# Altium project Solder-Station.PrjPcb
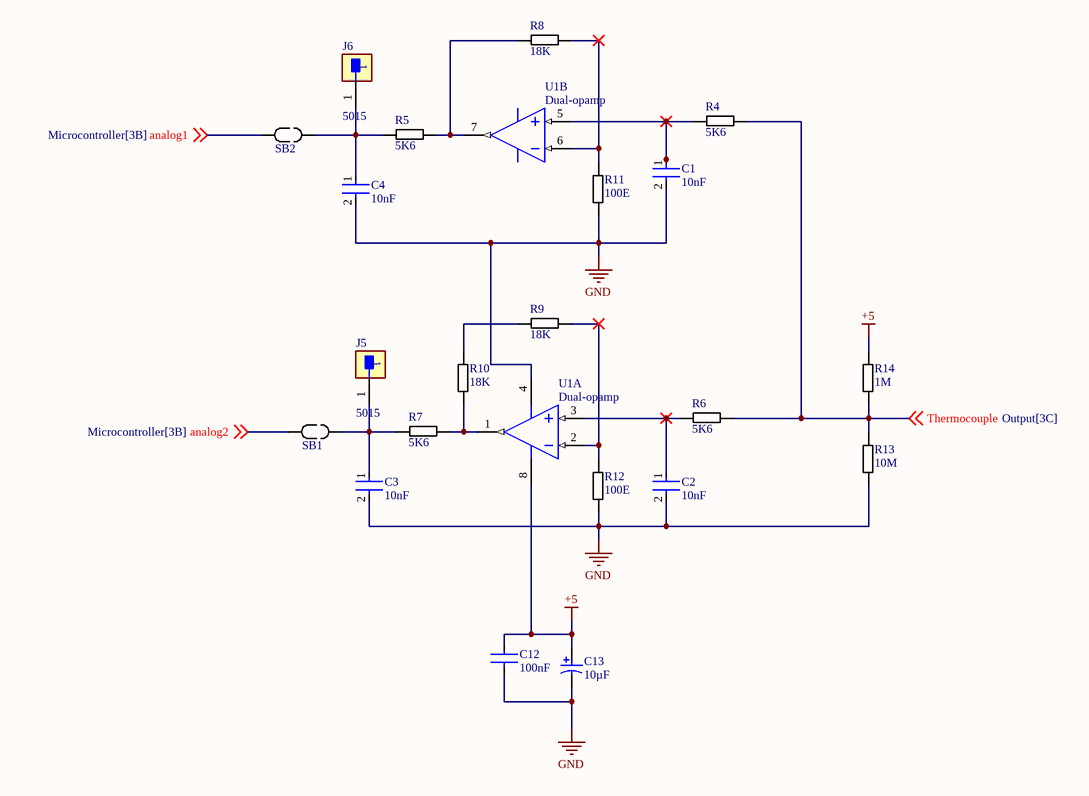
[diagram p0: Thermokoppel.SchDoc]
BladTitel: Soldeerstation; Numberofpages: 5; RevisionNumber: Rev1
4 sheets, 70 parts. Net scope: global (net labels, ports and power ports of the same name join across sheets).
Board file: PCB1.PcbDoc
Sheets:
  Thermokoppel.SchDoc
  Voeding.SchDoc
  Microcontroller.SchDoc
  Output.SchDoc

## Sheet Thermokoppel.SchDoc
size A4; SheetNumber: 1; SheetTotal: 4

### Parts
C1  10nF  [RESC2013X50X30ML20T20]
C2  10nF  [RESC2013X50X30ML20T20]
C3  10nF  [RESC2013X50X30ML20T20]
C4  10nF  [RESC2013X50X30ML20T20]
C12  100nF  [RESC2013X50X30ML20T20]
C13  10µF  [CAP-SMD_BD4.0-L4.3-W4.3-FD-LS5.3]
J5  5015  [5015]
J6  5015  [5015]
R4  5K6  [RESC2013X50X30ML20T20]
R5  5K6  [RESC2013X50X30ML20T20]
R6  5K6  [RESC2013X50X30ML20T20]
R7  5K6  [RESC2013X50X30ML20T20]
R8  18K  [RESC2013X50X30ML20T20]
R9  18K  [RESC2013X50X30ML20T20]
R10  18K  [RESC2013X50X30ML20T20]
R11  100E  [RESC2013X50X30ML20T20]
R12  100E  [RESC2013X50X30ML20T20]
R13  10M  [RESC2013X50X30ML20T20]
R14  1M  [RESC2013X50X30ML20T20]
SB1  SolderBridge  [SolderBridge]  (value not drawn)
SB2  SolderBridge  [SolderBridge]  (value not drawn)
U1  Dual-opamp  [MSOP_8_S]  (parts A,B of 2)

### Nets
+5: C12.1 C13.1(+) R14.2 U1.8(VDD)
GND: C1.2 C2.2 C3.2 C4.2 C12.2 C13.2(-) R11.1 R12.1 R13.1 U1.4(VSS)
analog1: SB2.1 ; off-sheet analog1
analog2: SB1.1 ; off-sheet analog2
Thermocouple: R4.2 R6.2 R13.2 R14.1 ; off-sheet Thermocouple
NetC1_1: C1.1 R4.1 U1.5(VINB+)
NetC2_1: C2.1 R6.1 U1.3(VINA+)
NetC3_1: C3.1 J5.1 R7.1 SB1.2
NetC4_1: C4.1 J6.1 R5.1 SB2.2
NetR5_2: R5.2 R8.1 U1.7(VOUTB)
NetR7_2: R7.2 R10.1 U1.1(VOUTA)
NetR8_2: R8.2 R11.2 U1.6(VINB-)
NetR9_1: R9.1 R10.2
NetR9_2: R9.2 R12.2 U1.2(VINA-)

### Library data of the parts
C1-C4 C12 = Capacitor: Voltage Rating (DC): 6.3V; Dielectric: X5R; Capacitance: 10uF; Material: Ceramic; Tolerance: 20%; Packaging: Tape and Reel; Width: 0.031inch; Termination: SMD/SMT; Package Quantity: 4000; Voltage Rating: 6.3V; Case/Package: 0603; Min Operating Temperature: -55°C; Voltage: 6.3V; Length: 1.6mm; Thickness: 0.035inch; Lead Free: Lead Free; Depth: 0.8mm; Case Code (Imperial): 0603; Max Operating Temperature: 85°C; Height: 0.8mm; Mount: Surface Mount; REACH SVHC: No SVHC; Radiation Hardening: No; Case Code (Metric): 1608
C13 = Electrolytic capacitor: Manufacturer: Panasonic; Voltage Rating: 25 V; ComponentLink2URL: http://industrial.panasonic.com/cdbs/www-data/pdf/RDE0000/ABA0000C1181.pdf; Height: 10.2 mm; Max Operating Temperature: 105 degC; PackageReference: EEE-FK1E221P; ComponentLink1Description: Manufacturer URL; ComponentLink1URL: http://www.panasonic.com/; Mount: Surface Mount; REACH SVHC: No SVHC; Min Operating Temperature: -55 degC; ComponentLink2Description: Datasheet; DatasheetVersion: 03/2016; Length: 10.2 mm; RoHSCompliant: true; Packaging: Tape and Reel; Package Quantity: 500; Lead Pitch: 3.1 mm; Pins: 2; PackageDescription: 2-Pin Electrolytic Aluminum Capacitor, Body 8.3 x 8.3 mm; Mounting Technology: Surface Mount
J5 J6 = Testpoint: PC TEST POINT MINIATURE; Manufacturer: keystone; Number Of Contacts: 1; Conn Orientation: Straight; Category: Conn; Manufacturer Part Number: 5015; Digikey Description: PC TEST POINT MINIATURE; Automotive: No; Lead Free: Yes; Octopart: https://octopart.com/5015-keystone-3822; ComponentLink2URL: http://www.keyelco.com/product-pdf.cfm?p=1353; Package: 5015; RoHS: TRUE; Device Class L3: unset; Device Class L2: unset; Contact Material: Silver; Device Class L1: Connectors; Height: 1.65mm; ComponentLink2Description: Datasheet
R4-R14 = Resistor: Manufacturer: Vishay Dale; Part Number: CRCW08050000Z0EA
U1 = Dual-opamp: Slew Rate: 0.6V/µs; Supply Current: 100uA; Power Supply Rejection Ratio (PSRR): 86dB; Input Offset Voltage (Vos): 4.5mV; Input Bias Current: 1pA; Amplifier Type: GENERAL PURPOSE; Unity Gain Bandwidth Product: 1MHz; Number of Circuits: 2; Output Current: 23mA; Operating Supply Voltage: 5.5V; Min Supply Voltage: 1.8V; Common Mode Rejection Ratio: 60dB; Voltage Gain: 112dB; Max Supply Voltage: 6V; Package Quantity: 60; REACH SVHC: No SVHC; Min Operating Temperature: -40°C; Max Operating Temperature: 125°C; Mount: Through Hole; Nominal Supply Current: 100uA; Height: 3.3mm; Length: 9.27mm; Slew Rate-Nom: 0.6V/µs; Packaging: Rail/Tube; Output Current per Channel: 23mA; Number of Amplifiers: 2; RoHS Compliant: Yes; Radiation Hardening: No; Bandwidth: 1MHz; Lead Free: Lead Free; Width: 6.35mm; Number of Channels: 2; Gain Bandwidth Product: 1MHz; Technology: CMOS; Operating Supply Current: 100uA; Number of Elements: 2; Number of Pins: 8; Input Offset Voltage-Max: 4.5mV; Case/Package: PDIP

## Sheet Voeding.SchDoc
size A4; SheetNumber: 2; SheetTotal: 4
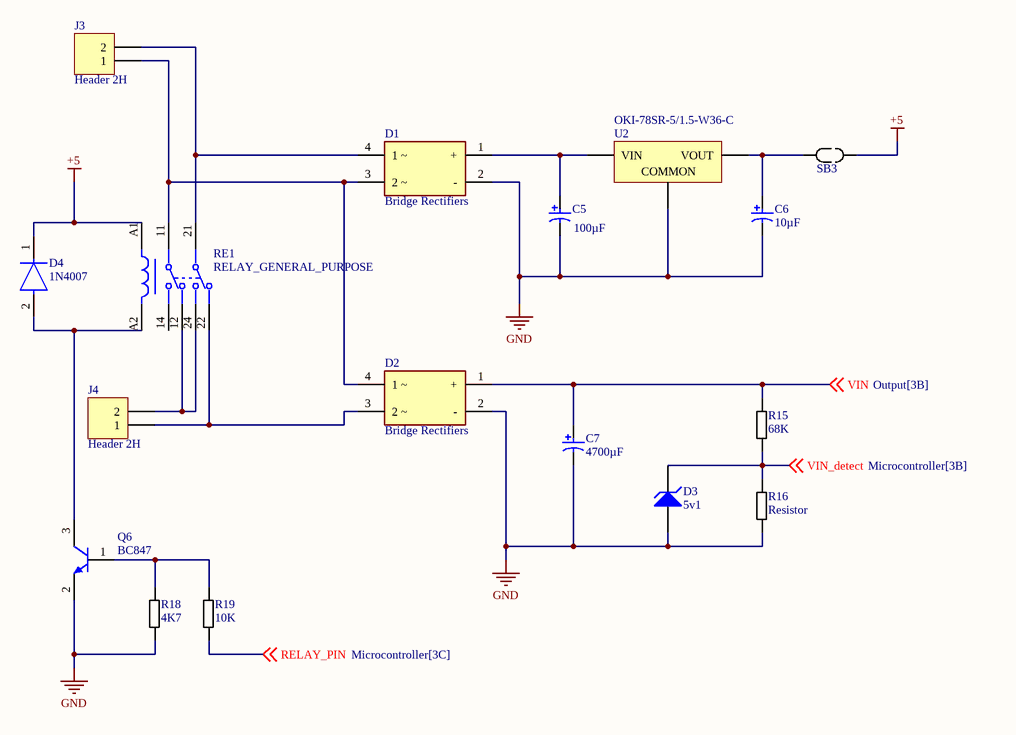
[diagram p1: Voeding.SchDoc]

### Parts
C5  100µF  [CAP-SMD_BD8.0-L8.3-W8.3-FD]
C6  10µF  [CAP-SMD_BD4.0-L4.3-W4.3-FD-LS5.3]
C7  4700µF  [CAP-TH_BD25.0-P10.00-D1.4-FD]
D1  Bridge Rectifiers  [TTF]
D2  Bridge Rectifiers  [TTF]
D3  5v1  [FP-SOD123-IPC_C]
D4  1N4007  [SOD-123FL]
J3  Header 2H  [Connector_2x1_p_5mm]
J4  Header 2H  [Connector_2x1_p_5mm]
Q6  BC847  [FAIR-SOT23-3_V]
R15  68K  [RESC2013X50X30ML20T20]
R16  Resistor  [RESC2013X50X30ML20T20]
R18  4K7  [RESC2013X50X30ML20T20]
R19  10K  [RESC2013X50X30ML20T20]
RE1  RELAY_GENERAL_PURPOSE  [RT42]
SB3  SolderBridge  [SolderBridge_BIG]  (value not drawn)
U2  OKI-78SR-5/1.5-W36-C  [OKI78SR515W36C]

### Nets
+5: D4.1(C) RE1.A1 SB3.2
GND: C5.2(-) C6.2(-) C7.2(-) D1.2(-) D2.2(-) D3.2(A) Q6.2(E) R16.1 R18.1 U2.2(COMMON)
RELAY_PIN: R19.1 ; off-sheet RELAY_PIN
VIN: C7.1(+) D2.1(+) R15.2 ; off-sheet VIN
VIN_detect: D3.1(K) R15.1 R16.2 ; off-sheet VIN_detect
NetC5_1: C5.1(+) D1.1(+) U2.1(VIN)
NetC6_1: C6.1(+) SB3.1 U2.3(VOUT)
NetD1_3: D1.3(2_~) D2.4(1_~) J3.1 RE1.11
NetD1_4: D1.4(1_~) J3.2 RE1.21
NetD2_3: D2.3(2_~) J4.1 RE1.22
NetD4_2: D4.2(A) Q6.3(C) RE1.A2
NetJ4_2: J4.2 RE1.12 RE1.24
NetQ6_1: Q6.1(B) R18.2 R19.2

Not connected (* = marked no-connect by the designer): RE1 14

### Library data of the parts
C5-C7 = Electrolytic capacitor: as C13 on sheet Thermokoppel; ComponentLink2URL: http://industrial.panasonic.com/cdbs/www-data/pdf/RDE0000/ABA0000C1181.pdf; Height: 10.2 mm; Max Operating Temperature: 105 degC; PackageReference: EEE-FK1E221P; ComponentLink1Description: Manufacturer URL; ComponentLink1URL: http://www.panasonic.com/; Mount: Surface Mount; REACH SVHC: No SVHC; Min Operating Temperature: -55 degC; ComponentLink2Description: Datasheet; DatasheetVersion: 03/2016; Length: 10.2 mm; RoHSCompliant: true; Packaging: Tape and Reel; Package Quantity: 500; Lead Pitch: 3.1 mm; Pins: 2; PackageDescription: 2-Pin Electrolytic Aluminum Capacitor, Body 8.3 x 8.3 mm; Mounting Technology: Surface Mount
D1 D2 = Bridge Rectifiers: Manufacturer Part Number: GBPC3510W T0; Manufacturer: Taiwan Semiconductor; Max Repetitive Reverse Voltage: 1000V; Peak Reverse Current: 5uA; Max Surge Forward Current: 400A; Forward Current: 35A; Max Junction Temp: +150°C; RoHS: TRUE; Package: GBPC-W; Reverse Voltage: 1000V; Temperature Range High: +150°C; Lead Free: Yes; ComponentLink2Description: Datasheet; Temperature Range Low: -55°C; Device Class L3: Rectifier Diodes; Temperature: -55°C to +150°C; Category: Diode; Octopart: https://octopart.com/gbpc3510w+t0-taiwan+semiconductor-12450781; Height: 11.23mm; ComponentLink2URL: https://www.taiwansemi.com/products/datasheet/GBPC%2015005%20SERIES_K14.pdf; Automotive: No; Device Class L2: Diodes; Device Class L1: Discrete Semiconductors
D3 = Zener: Manufacturer: On Semiconductor; PartNumber: 1SMB5928BT3G; VZ Typ (V): 13; Packing: Tape and Reel; PackageDescription: 2-Pin Small Molded Package, J-Bend Lead, Body 4.33 x 3.625 mm; PackageVersion: Rev. H, 05/2011; ComponentLink1Description: Manufacturer URL; Mounting Technology: Surface Mount; ComponentLink1URL: http://www.onsemi.com/; ComponentLink2Description: Datasheet; ComponentLink3URL: http://www.onsemi.com/pub_link/Collateral/1SMB5913BT3-D.PDF; PackageReference: SMB-2-403A-03_H; ComponentLink2URL: http://www.onsemi.com/pub_link/Collateral/1SMB5913BT3-D.PDF; DatasheetVersion: Rev. 8; RoHS: Pb-Free; ComponentLink3Description: Package Specification
D4 = Diode: Manufacturer: Vishay; Manufacturer Part Number: 1N4007-E3/54; Value: 15pF; Max Junction Temp: +150°C; Max Surge Forward Current: 30A; Forward Current: 1A; Max Repetitive Reverse Voltage: 1000V; Peak Reverse Current: 30uA; Octopart: https://octopart.com/1n4007-e3%2F54-vishay-39548207; Digikey Description: DIODE GEN PURP 1KV 1A DO204AL; Category: Diode; Mouser Description: Rectifiers Vr/1000V Io/1A; Automotive: No; Package: 1N4007; Device Class L3: Rectifier Diodes; Temperature Range High: +150°C; Capacitance: 15pF; Ipc Land Pattern Name: DIOPA1088W105L520D270; Lead Free: Yes; ComponentLink2Description: Datasheet; Device Class L1: Discrete Semiconductors; ComponentLink2URL: http://www.vishay.com/docs/88503/1n4001.pdf; Temperature Range Low: -50°C; Height: 2.7mm; RoHS: TRUE; Temperature: -50°C to +150°C; Device Class L2: Diodes
J3 J4 = Header 2H: Header, 2-Pin, Right Angle; LatestRevisionDate: 17-Jul-2002; LatestRevisionNote: Re-released for DXP Platform.; Publisher: Altium Limited
Q6 = NPN Transistor: Manufacturer: On Semiconductor; PartNumber: BC547BRL1G; IC Continuous (A): 0.1; fT Min (MHz): 150; Packing: Tape and Reel; Polarity: NPN; ComponentLink2URL: http://www.onsemi.com/pub_link/Collateral/BC546-D.PDF; ComponentLink1URL: http://www.onsemi.com/; ComponentLink2Description: Datasheet; RoHS: TRUE; ComponentLink3Description: Package Specification; ComponentLink1Description: Manufacturer URL; ComponentLink3URL: http://www.onsemi.com/pub_link/Collateral/MAC97-D.PDF; PackageDescription: 3-Pin Transistor Outline, Body 4.825 x 3.685 mm, Pitch 1.27 mm; PackageVersion: Rev. AM; DatasheetVersion: Rev. 7; Mounting Technology: Through Hole; PackageReference: TO-92-3-29-11_AM_BL
R15 R16 R18 R19 = Resistor: as R4 on sheet Thermokoppel
RE1 = RELAY_GENERAL_PURPOSE: Manufacturer Part Number: RT424005; Manufacturer: TE Connectivity; Coil Power: 403mW; Throw Configuration: DPDT; Coil Voltage: 5V; Number Of Contacts: 2; Coil Resistance: 62Ω; Current Rating: 8A; Coil Type: Non-Latching; Category: Relay; Octopart: https://octopart.com/5-1393243-9-te+connectivity-41835766; Device Class L3: Power Relays; ComponentLink2URL: https://www.te.com/commerce/DocumentDelivery/DDEController?Action=showdoc&DocId=Data+Sheet%7FRT2%7F1014%7Fpdf%7FEnglish%7FENG_DS_RT2_1014.pdf%7F5-1393243-9; Ambient Temperature Range High: +85°C; ComponentLink2Description: Datasheet; Digikey Description: RELAY GENERAL PURPOSE DPDT 8A 5V; Package: RT424005; Automotive: No; Device Class L1: Electromechanical; Height: 15.7mm; Device Class L2: Relays; Ambient Temperature Range Low: -40°C; Mouser Description: General Purpose Relay, Rt2 Series, Power, Non Latching, Dpdt, 5 Vdc, 8 A Rohs Compliant: Yes; Lead Free: Yes; RoHS: TRUE
U2 = DC/DC Converter: Manufacturer: Murata; Current - Output (Max): 1.5A; Power (Watts) - Max: 8W; Efficiency: 90.5%; Voltage - Input (Min): 7V; Voltage - Input (Max): 36V; Voltage - Output 1: 5V; Number of Outputs: 1; Package / Case: 3-SIPModule; Features: SCP; Type: LinearRegulatorReplacement; Size / Dimension: 0.41"Lx0.30"Wx0.65"H(10.4mmx7.6mmx16.5mm); Datasheet URL: https://datasheet.ciiva.com/8006/1790439-8006672.pdf; Datasheet Version: Oct-13; Power (Watts) - Manufacture Series: 8W; Voltage - Output 2: -; Series: Okami™OKI-78SR; Family: DCDCConverters; Manufacturer URL: http://www.murata.com/; Category: PowerSupplies-BoardMount; Voltage - Isolation: -; Packaging: Tube; Applications: ITE(Commercial); Mounting Type: ThroughHole; Voltage - Output 3: -; Operating Temperature: -40degC~85degC

## Sheet Microcontroller.SchDoc
size A4; SheetNumber: 3; SheetTotal: 4
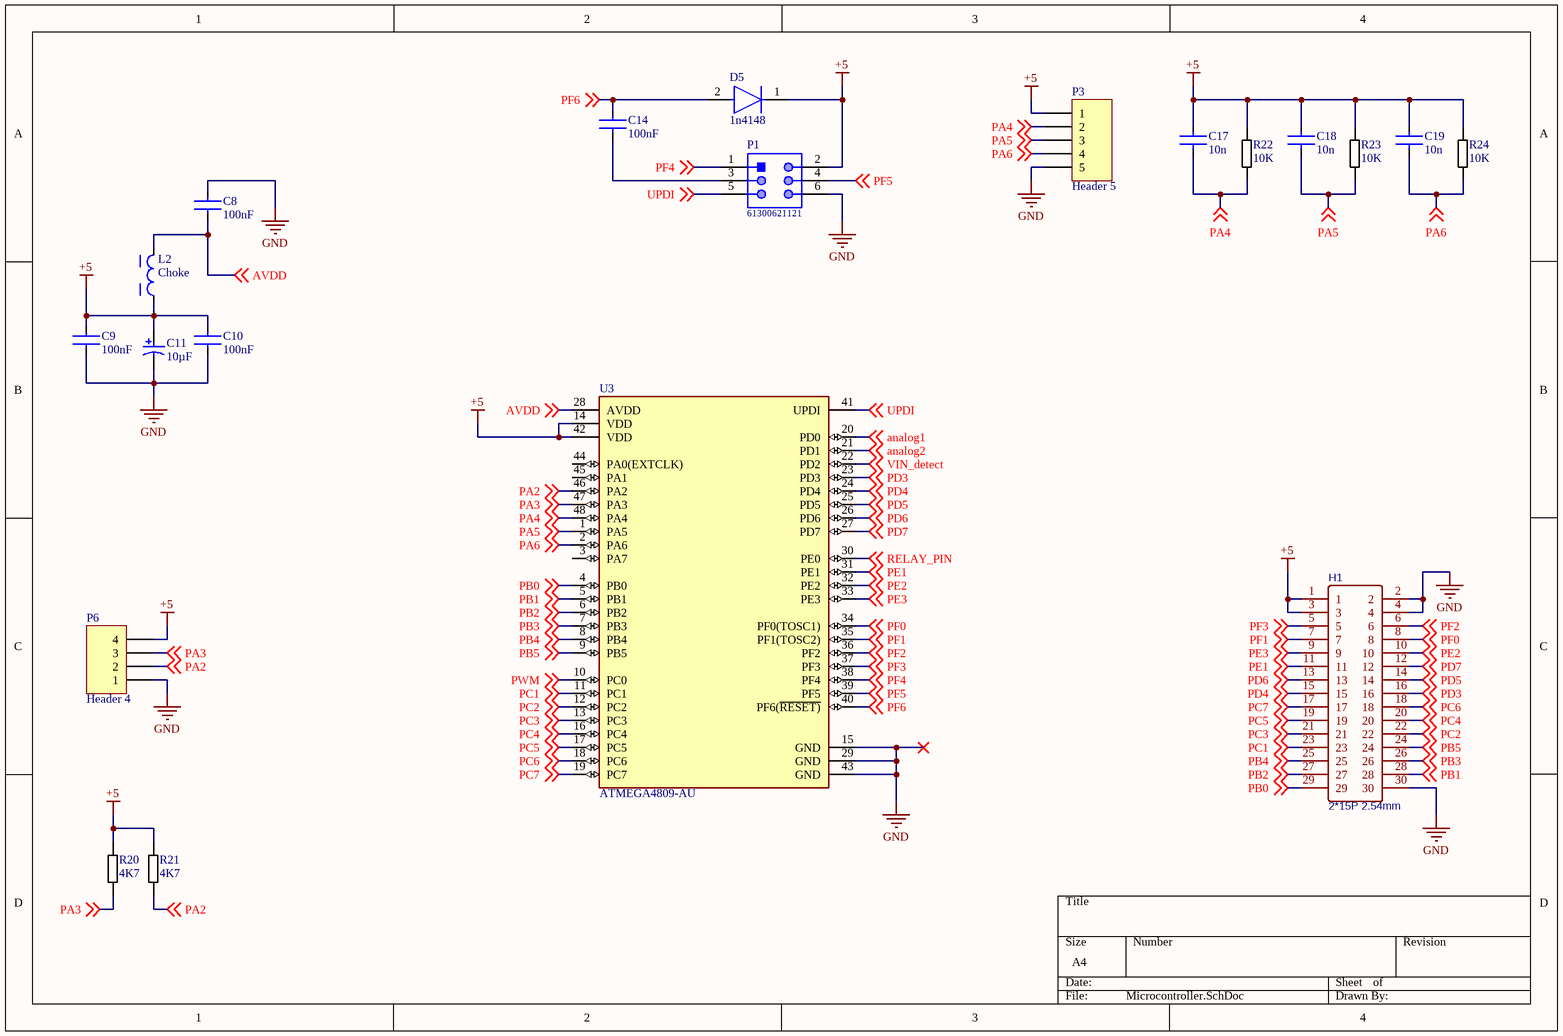
[diagram p2: Microcontroller.SchDoc]

### Parts
C8  100nF  [RESC2013X50X30ML20T20]
C9  100nF  [RESC2013X50X30ML20T20]
C10  100nF  [RESC2013X50X30ML20T20]
C11  10µF  [CAP-SMD_BD4.0-L4.3-W4.3-FD-LS5.3]
C14  100nF  [RESC2013X50X30ML20T20]
C17  10n  [RESC2013X50X30ML20T20]
C18  10n  [RESC2013X50X30ML20T20]
C19  10n  [RESC2013X50X30ML20T20]
D5  1n4148  [SOD-123FL]
H1  2*15P 2.54mm  [HDR-TH_30P-P2.54-V-M-R2-C15-S2.54]
L2  Choke  [RESC2013X50X30ML20T20]
P1  61300621121  [61300621121]
P3  Header 5  [HDR1X5]
P6  Header 4  [HDR1X4]
R20  4K7  [RESC2013X50X30ML20T20]
R21  4K7  [RESC2013X50X30ML20T20]
R22  10K  [RESC2013X50X30ML20T20]
R23  10K  [RESC2013X50X30ML20T20]
R24  10K  [RESC2013X50X30ML20T20]
U3  ATMEGA4809-AU  [FP-C04-300-PT-IPC_A]

### Nets
+5: C9.1 C10.1 C11.1(+) C17.1 C18.1 C19.1 D5.1(C) H1.1 H1.3 L2.1 P1.2 P3.1 P6.4 R20.2 R21.2 R22.2 R23.2 R24.2 U3.14(VDD) U3.42(VDD)
GND: C8.1 C9.2 C10.2 C11.2(-) H1.2 H1.4 H1.30 P1.6 P3.5 P6.1 U3.15(GND) U3.29(GND) U3.43(GND)
analog1: U3.20(PD0) ; off-sheet analog1
analog2: U3.21(PD1) ; off-sheet analog2
AVDD: C8.2 L2.2 U3.28(AVDD) ; off-sheet AVDD
PA2: P6.2 R21.1 U3.46(PA2) ; off-sheet PA2
PA3: P6.3 R20.1 U3.47(PA3) ; off-sheet PA3
PA4: C17.2 P3.2 R22.1 U3.48(PA4) ; off-sheet PA4
PA5: C18.2 P3.3 R23.1 U3.1(PA5) ; off-sheet PA5
PA6: C19.2 P3.4 R24.1 U3.2(PA6) ; off-sheet PA6
PB0: H1.29 U3.4(PB0) ; off-sheet PB0
PB1: H1.28 U3.5(PB1) ; off-sheet PB1
PB2: H1.27 U3.6(PB2) ; off-sheet PB2
PB3: H1.26 U3.7(PB3) ; off-sheet PB3
PB4: H1.25 U3.8(PB4) ; off-sheet PB4
PB5: H1.24 U3.9(PB5) ; off-sheet PB5
PC1: H1.23 U3.11(PC1) ; off-sheet PC1
PC2: H1.22 U3.12(PC2) ; off-sheet PC2
PC3: H1.21 U3.13(PC3) ; off-sheet PC3
PC4: H1.20 U3.16(PC4) ; off-sheet PC4
PC5: H1.19 U3.17(PC5) ; off-sheet PC5
PC6: H1.18 U3.18(PC6) ; off-sheet PC6
PC7: H1.17 U3.19(PC7) ; off-sheet PC7
PD3: H1.16 U3.23(PD3) ; off-sheet PD3
PD4: H1.15 U3.24(PD4) ; off-sheet PD4
PD5: H1.14 U3.25(PD5) ; off-sheet PD5
PD6: H1.13 U3.26(PD6) ; off-sheet PD6
PD7: H1.12 U3.27(PD7) ; off-sheet PD7
PE1: H1.11 U3.31(PE1) ; off-sheet PE1
PE2: H1.10 U3.32(PE2) ; off-sheet PE2
PE3: H1.9 U3.33(PE3) ; off-sheet PE3
PF0: H1.8 U3.34(PF0(TOSC1)) ; off-sheet PF0
PF1: H1.7 U3.35(PF1(TOSC2)) ; off-sheet PF1
PF2: H1.6 U3.36(PF2) ; off-sheet PF2
PF3: H1.5 U3.37(PF3) ; off-sheet PF3
PF4: P1.1 U3.38(PF4) ; off-sheet PF4
PF5: P1.4 U3.39(PF5) ; off-sheet PF5
PF6: C14.1 D5.2(A) U3.40(PF6(~{RESET)}) ; off-sheet PF6
PWM: U3.10(PC0) ; off-sheet PWM
RELAY_PIN: U3.30(PE0) ; off-sheet RELAY_PIN
UPDI: P1.5 U3.41(UPDI) ; off-sheet UPDI
VIN_detect: U3.22(PD2) ; off-sheet VIN_detect
NetC14_2: C14.2 P1.3

Not connected (* = marked no-connect by the designer): U3 3(PA7) 44(PA0(EXTCLK)) 45(PA1)

### Library data of the parts
C8-C10 C14 C17-C19 = Capacitor: as C1 on sheet Thermokoppel; Packaging: Tape and Reel; Width: 0.031inch; Termination: SMD/SMT; Package Quantity: 4000; Voltage Rating: 6.3V; Case/Package: 0603; Min Operating Temperature: -55°C; Voltage: 6.3V; Length: 1.6mm; Thickness: 0.035inch; Lead Free: Lead Free; Depth: 0.8mm; Case Code (Imperial): 0603; Max Operating Temperature: 85°C; Height: 0.8mm; Mount: Surface Mount; REACH SVHC: No SVHC; Radiation Hardening: No; Case Code (Metric): 1608
C11 = Electrolytic capacitor: as C13 on sheet Thermokoppel; ComponentLink2URL: http://industrial.panasonic.com/cdbs/www-data/pdf/RDE0000/ABA0000C1181.pdf; Height: 10.2 mm; Max Operating Temperature: 105 degC; PackageReference: EEE-FK1E221P; ComponentLink1Description: Manufacturer URL; ComponentLink1URL: http://www.panasonic.com/; Mount: Surface Mount; REACH SVHC: No SVHC; Min Operating Temperature: -55 degC; ComponentLink2Description: Datasheet; DatasheetVersion: 03/2016; Length: 10.2 mm; RoHSCompliant: true; Packaging: Tape and Reel; Package Quantity: 500; Lead Pitch: 3.1 mm; Pins: 2; PackageDescription: 2-Pin Electrolytic Aluminum Capacitor, Body 8.3 x 8.3 mm; Mounting Technology: Surface Mount
D5 = Diode: as D4 on sheet Voeding; Octopart: https://octopart.com/1n4007-e3%2F54-vishay-39548207; Digikey Description: DIODE GEN PURP 1KV 1A DO204AL; Category: Diode; Mouser Description: Rectifiers Vr/1000V Io/1A; Automotive: No; Package: 1N4007; Device Class L3: Rectifier Diodes; Temperature Range High: +150°C; Capacitance: 15pF; Ipc Land Pattern Name: DIOPA1088W105L520D270; Lead Free: Yes; ComponentLink2Description: Datasheet; Device Class L1: Discrete Semiconductors; ComponentLink2URL: http://www.vishay.com/docs/88503/1n4001.pdf; Temperature Range Low: -50°C; Height: 2.7mm; RoHS: TRUE; Temperature: -50°C to +150°C; Device Class L2: Diodes
H1 = 2*15P 2.54mm: BOM_Manufacturer: Ckmtw(灿科盟); BOM_Manufacturer Part: B-2100S30P-B110; Contributor: LCSC; BOM_Supplier: LCSC; BOM_Supplier Part: C169817; BOM_JLCPCB Part Class: Extended Part; spicePre: H; spiceSymbolName: 2*15P 2.54mm
L2 = Choke: Tolerance: 20%; Shielding: Shielded; Saturation Current: 10A; Test Frequency: 100kHz; RMS Current (Irms): 8.5A; Inductance: 10uH; Series Resistance: 14.1R; DC Resistance (DCR): 14.1mR; Self Resonant Frequency: 18MHz; Ratings: AEC-Q200; Width: 12.8mm; Series: WE-HCI; Length: 0.512inch; Mount: Surface Mount; Resistor Type: Wirewound; RoHS Compliant: Yes; Package Quantity: 1; Min Operating Temperature: -40°C; Inductance Tolerance: 20%; Termination: SMD/SMT; Max DC Current: 8.5A; Height - Seated (Max): 0.197inch; Case/Package: 1350; Current Rating: 8.5A; Max Operating Temperature: 155°C; Packaging: Tape and Reel; Height: 4.7mm
P1 = CMP-1502-01072-1: THT Vertical Pin Header WR-PHD, Pitch 2.54 mm, Dual Row, 6 pins; Manufacturer: Wurth Elektronik; Contact Resistance: 20mOhm; Withstanding Voltage: 500VAC; Pin Number: 6; Gender: Male; Pitch: 2.54mm; Working Voltage: 250VAC; Rated Current: 3A; Packaging: Bag; Row Number: Dual; Manufacturer URL: http://www.we-online.de; Part Number: 61300621121; Operating Temperature: -40to105degC; Mounting Technology: THT; Package Reference: 61300621121; Datasheet URL: https://katalog.we-online.de/em/datasheet/6130xx21121.pdf; Orientation: Vertical; Publisher: WurthElektronik
P3 = Header 5: Header, 5-Pin; LatestRevisionDate: 17-Jul-2002; LatestRevisionNote: Re-released for DXP Platform.; Publisher: Altium Limited
P6 = Header 4: Header, 4-Pin; LatestRevisionDate: 17-Jul-2002; LatestRevisionNote: Re-released for DXP Platform.; Publisher: Altium Limited
R20-R24 = Resistor: as R4 on sheet Thermokoppel
U3 = MCU: MCU 8-BIT; Peripherals: Brown-out Detect/Reset; Number of I/Os: 41; Core Architecture: AVR; Memory Size: 48KB; Interface: I2C; Oscillator Type: Internal; Memory Type: FLASH; Series: megaAVR® 0, Functional Safety (FuSa); Min Operating Temperature: -40°C; Mount: Surface Mount; Case/Package: TQFP; RoHS Compliant: Yes; Max Operating Temperature: 85°C

## Sheet Output.SchDoc: SoldeerStation
size A4; SheetNumber: 4; SheetTotal: 4
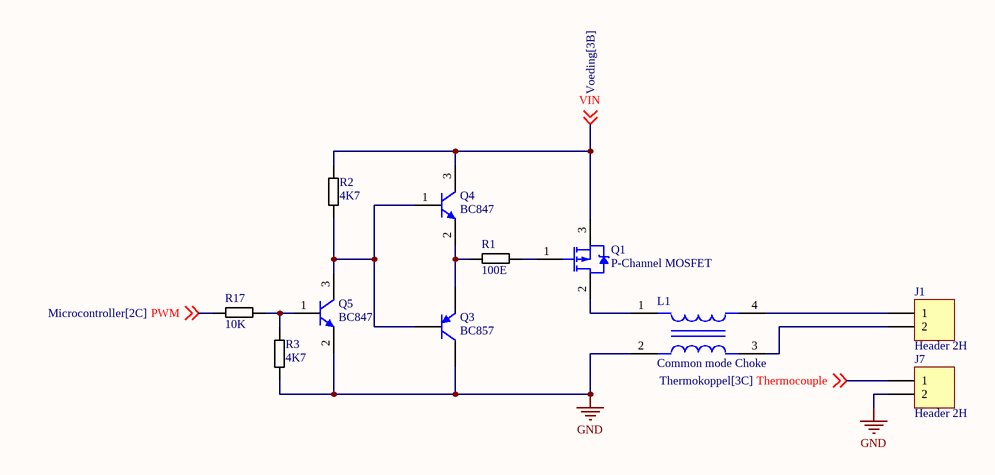
[diagram p3: Output.SchDoc]

### Parts
J1  Header 2H  [Connector_2x1_p_5mm]
J7  Header 2H  [Connector_2x1_p_5mm]
L1  Common mode Choke  [2545]
Q1  P-Channel MOSFET  [INF-PG-TO252-3-313_N]
Q3  BC857  [FAIR-SOT23-3_V]
Q4  BC847  [FAIR-SOT23-3_V]
Q5  BC847  [FAIR-SOT23-3_V]
R1  100E  [RESC2013X50X30ML20T20]
R2  4K7  [RESC2013X50X30ML20T20]
R3  4K7  [RESC2013X50X30ML20T20]
R17  10K  [RESC2013X50X30ML20T20]

### Nets
GND: J7.2 L1.2 Q3.3(C) Q5.2(E) R3.1
PWM: R17.1 ; off-sheet PWM
Thermocouple: J7.1 ; off-sheet Thermocouple
VIN: Q1.3(S) Q4.3(C) R2.2 ; off-sheet VIN
NetJ1_1: J1.1 L1.4
NetJ1_2: J1.2 L1.3
NetL1_1: L1.1 Q1.2(D)
NetQ1_1: Q1.1(G) R1.2
NetQ3_1: Q3.1(B) Q4.1(B) Q5.3(C) R2.1
NetQ3_2: Q3.2(E) Q4.2(E) R1.1
NetQ5_1: Q5.1(B) R3.2 R17.2

### Library data of the parts
J1 J7 = Header 2H: Header, 2-Pin, Right Angle; LatestRevisionDate: 17-Jul-2002; LatestRevisionNote: Re-released for DXP Platform.; Publisher: Altium Limited
L1 = Common mode Choke: Max Current Rating: 2A; Number of Lines: 2; Impedance: 900R; Element Configuration: Dual; Insulation Resistance: 10MR; Test Frequency: 100MHz; DC Resistance (DCR): 60mR; Voltage Rating (DC): 50V; Current Rating: 2.3A; Number of Pins: 4; DC Current: 2A; Mount: Surface Mount; Current: 2A; REACH SVHC: No SVHC; Width: 4.5mm; Case/Package: 1808; Voltage Rating: 50V; Package Quantity: 1; Height: 2mm; Max DC Current: 2A; Packaging: Tape and Reel; Max Operating Temperature: 85°C; Lead Free: Lead Free; Length: 0.185inch; Series: ACM; Radiation Hardening: No; Max Voltage Rating (DC): 50V; Termination: Flat; Depth: 4.7mm; RoHS Compliant: Yes; DC Resistance-Max: 60mR; Min Operating Temperature: -40°C
Q1 = P-Channel MOSFET: PartNumber: NTB5605PT4G; Manufacturer: On Semiconductor; ID Max (A): 18.5; VGS(th) Max (V): 2; Configuration: Single; Packing: Tape and Reel; Coss Typ (pF): 211; V(BR)DSS Min (V): 60; Qrr Typ (nC): 0.14; Channel Polarity: P Channel; Crss Typ (pF): 67; VGS Max (V): 20; Ciss Typ (pF): 730; PD Max (W): 88; ComponentLink1URL: http://www.onsemi.com/; ComponentLink3URL: http://www.onsemi.com/pub_link/Collateral/418B-04.PDF; PackageVersion: Rev. K, 09/2008; ComponentLink2Description: Datasheet; ComponentLink3Description: Package Specification; Package Type: D2PAK-3; ComponentLink2URL: http://www.onsemi.cn/pub_link/Collateral/NTB5605P-D.PDF; Mounting Technology: Surface Mount; ComponentLink1Description: Manufacturer URL; PackageReference: D2PAK-3-418B-04; DatasheetVersion: Rev. 4; PackageDescription: 3-Pin Flange Mount, Body 9.145 x 9.97 mm, Pitch 2.54 mm; RoHS: Pb-Free
Q3 = PNP transistor: Manufacturer: On Semiconductor; PartNumber: BC557BRL1G; IC Continuous (A): -0.1; Polarity: PNP; Packing: Tape and Reel; ComponentLink2URL: http://www.onsemi.com/pub_link/Collateral/BC556B-D.PDF; ComponentLink3URL: http://www.onsemi.com/pub_link/Collateral/MAC97-D.PDF; Mounting Technology: Through Hole; RoHS: TRUE; DatasheetVersion: Rev. 3; PackageReference: TO-92-3-29-11_AM_BL; PackageVersion: Rev. AM; PackageDescription: 3-Pin Transistor Outline, Body 4.825 x 3.685 mm, Pitch 1.27 mm; ComponentLink1URL: http://www.onsemi.com/; ComponentLink1Description: Manufacturer URL; ComponentLink2Description: Datasheet; ComponentLink3Description: Package Specification
Q4 Q5 = NPN Transistor: as Q6 on sheet Voeding; ComponentLink2URL: http://www.onsemi.com/pub_link/Collateral/BC546-D.PDF; ComponentLink1URL: http://www.onsemi.com/; ComponentLink2Description: Datasheet; RoHS: TRUE; ComponentLink3Description: Package Specification; ComponentLink1Description: Manufacturer URL; ComponentLink3URL: http://www.onsemi.com/pub_link/Collateral/MAC97-D.PDF; PackageDescription: 3-Pin Transistor Outline, Body 4.825 x 3.685 mm, Pitch 1.27 mm; PackageVersion: Rev. AM; DatasheetVersion: Rev. 7; Mounting Technology: Through Hole; PackageReference: TO-92-3-29-11_AM_BL
R1-R3 R17 = Resistor: as R4 on sheet Thermokoppel

## Nets that join several sheets
+5: Thermokoppel (C12.1 C13.1 R14.2 U1.8), Voeding (D4.1 RE1.A1 SB3.2), Microcontroller (20 pins)
GND: Thermokoppel (10 pins), Voeding (10 pins), Microcontroller (13 pins), Output (5 pins)
analog1: Thermokoppel (SB2.1), Microcontroller (U3.20)
analog2: Thermokoppel (SB1.1), Microcontroller (U3.21)
PWM: Microcontroller (U3.10), Output (R17.1)
RELAY_PIN: Voeding (R19.1), Microcontroller (U3.30)
Thermocouple: Thermokoppel (R4.2 R6.2 R13.2 R14.1), Output (J7.1)
VIN: Voeding (C7.1 D2.1 R15.2), Output (Q1.3 Q4.3 R2.2)
VIN_detect: Voeding (D3.1 R15.1 R16.2), Microcontroller (U3.22)